# Altium schematic sheet Relay.SchDoc
size A
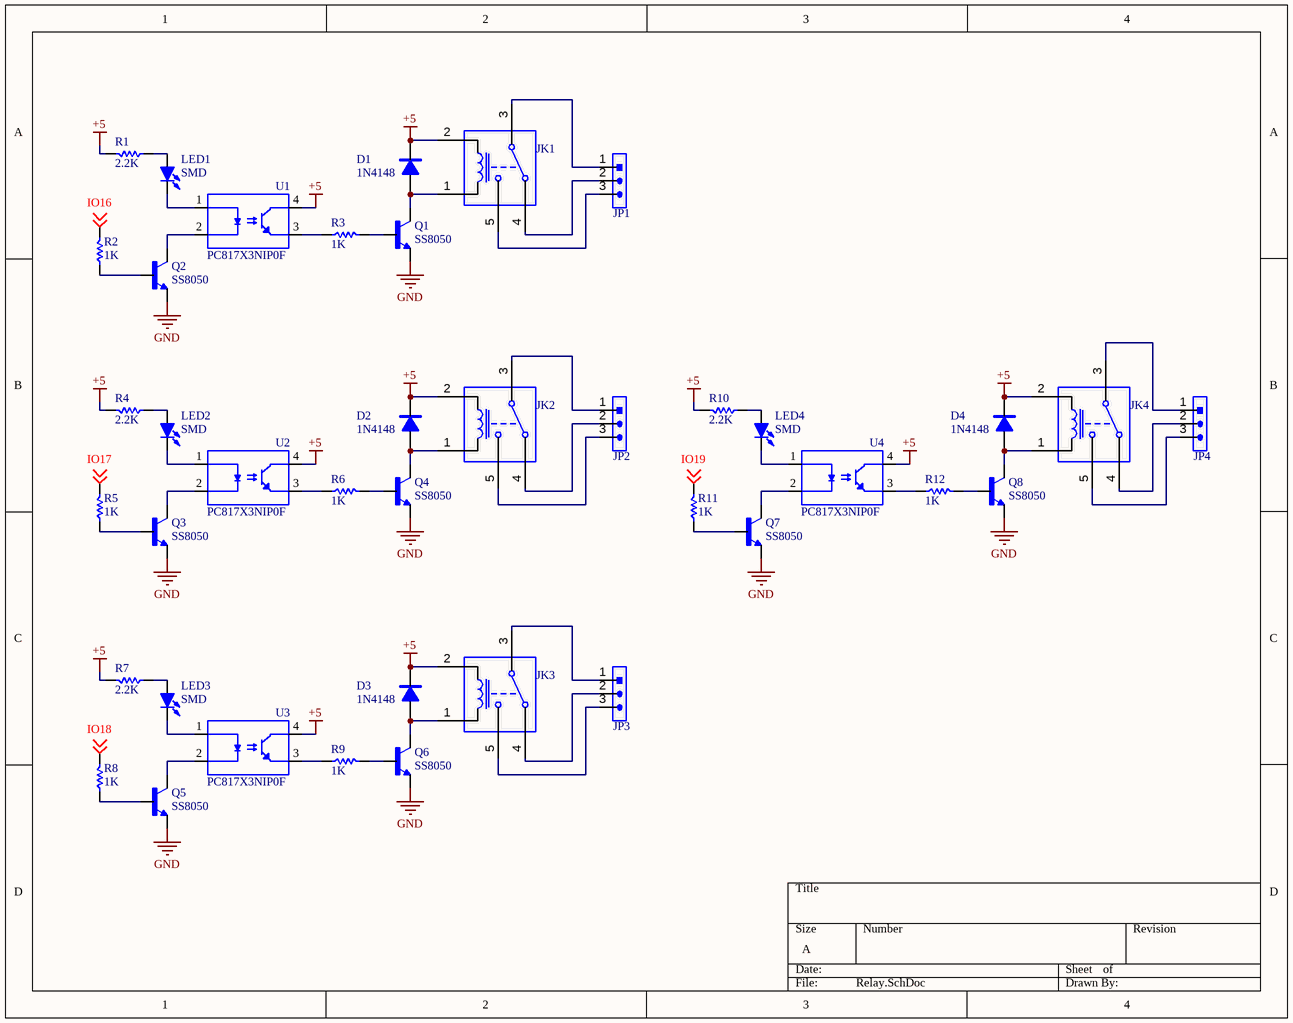
[diagram p0: Relay.SchDoc]

## Parts
D1  1N4148  [MINI_MELF (LL34)]
D2  1N4148  [MINI_MELF (LL34)]
D3  1N4148  [MINI_MELF (LL34)]
D4  1N4148  [MINI_MELF (LL34)]
JK1  SRD-05VDC-SL-C  [SRD-C_B]  (value not drawn)
JK2  SRD-05VDC-SL-C  [SRD-C_B]  (value not drawn)
JK3  SRD-05VDC-SL-C  [SRD-C_B]  (value not drawn)
JK4  SRD-05VDC-SL-C  [SRD-C_B]  (value not drawn)
JP1  HDR-1X3  [KF301-3P]  (value not drawn)
JP2  HDR-1X3  [KF301-3P]  (value not drawn)
JP3  HDR-1X3  [KF301-3P]  (value not drawn)
JP4  HDR-1X3  [KF301-3P]  (value not drawn)
LED1  SMD  [LED 0805B]
LED2  SMD  [LED 0805B]
LED3  SMD  [LED 0805B]
LED4  SMD  [LED 0805B]
Q1  SS8050  [SOT23-BEC]
Q2  SS8050  [SOT23-BEC]
Q3  SS8050  [SOT23-BEC]
Q4  SS8050  [SOT23-BEC]
Q5  SS8050  [SOT23-BEC]
Q6  SS8050  [SOT23-BEC]
Q7  SS8050  [SOT23-BEC]
Q8  SS8050  [SOT23-BEC]
R1  2.2K  [R 0805]
R2  1K  [R 0805]
R3  1K  [R 0805]
R4  2.2K  [R 0805]
R5  1K  [R 0805]
R6  1K  [R 0805]
R7  2.2K  [R 0805]
R8  1K  [R 0805]
R9  1K  [R 0805]
R10  2.2K  [R 0805]
R11  1K  [R 0805]
R12  1K  [R 0805]
U1  PC817X3NIP0F  [SOIC254P1000X400-4N]
U2  PC817X3NIP0F  [SOIC254P1000X400-4N]
U3  PC817X3NIP0F  [SOIC254P1000X400-4N]
U4  PC817X3NIP0F  [SOIC254P1000X400-4N]

## Nets
+5: D1.2(K) D2.2(K) D3.2(K) D4.2(K) JK1.2(Coil_2) JK2.2(Coil_2) JK3.2(Coil_2) JK4.2(Coil_2) R1.2 R4.2 R7.2 R10.2 U1.4(COLLECTOR) U2.4(COLLECTOR) U3.4(COLLECTOR) U4.4(COLLECTOR)
GND: Q1.E Q2.E Q3.E Q4.E Q5.E Q6.E Q7.E Q8.E
IO16: R2.2 ; off-sheet IO16
IO17: R5.2 ; off-sheet IO17
IO18: R8.2 ; off-sheet IO18
IO19: R11.2 ; off-sheet IO19
NetD1_1: D1.1(A) JK1.1(Coil_1) Q1.C
NetD2_1: D2.1(A) JK2.1(Coil_1) Q4.C
NetD3_1: D3.1(A) JK3.1(Coil_1) Q6.C
NetD4_1: D4.1(A) JK4.1(Coil_1) Q8.C
NetJK1_3: JK1.3 JP1.1
NetJK1_4: JK1.4 JP1.2
NetJK1_5: JK1.5 JP1.3
NetJK2_3: JK2.3 JP2.1
NetJK2_4: JK2.4 JP2.2
NetJK2_5: JK2.5 JP2.3
NetJK3_3: JK3.3 JP3.1
NetJK3_4: JK3.4 JP3.2
NetJK3_5: JK3.5 JP3.3
NetJK4_3: JK4.3 JP4.1
NetJK4_4: JK4.4 JP4.2
NetJK4_5: JK4.5 JP4.3
NetLED1_1: LED1.1(A) R1.1
NetLED1_2: LED1.2(K) U1.1(ANODE)
NetLED2_1: LED2.1(A) R4.1
NetLED2_2: LED2.2(K) U2.1(ANODE)
NetLED3_1: LED3.1(A) R7.1
NetLED3_2: LED3.2(K) U3.1(ANODE)
NetLED4_1: LED4.1(A) R10.1
NetLED4_2: LED4.2(K) U4.1(ANODE)
NetQ1_B: Q1.B R3.2
NetQ2_B: Q2.B R2.1
NetQ2_C: Q2.C U1.2(CATHODE)
NetQ3_B: Q3.B R5.1
NetQ3_C: Q3.C U2.2(CATHODE)
NetQ4_B: Q4.B R6.2
NetQ5_B: Q5.B R8.1
NetQ5_C: Q5.C U3.2(CATHODE)
NetQ6_B: Q6.B R9.2
NetQ7_B: Q7.B R11.1
NetQ7_C: Q7.C U4.2(CATHODE)
NetQ8_B: Q8.B R12.2
NetR3_1: R3.1 U1.3(EMITTER)
NetR6_1: R6.1 U2.3(EMITTER)
NetR9_1: R9.1 U3.3(EMITTER)
NetR12_1: R12.1 U4.3(EMITTER)

## Library data of the parts
D1-D4 = 1N4148: High speed switching diode; BOM名称: 高速开关二极管; 版权归属: 源创客; 学习资源: www.ooocke.com
JK1-JK4 = SRD-05VDC-SL-C: 5V单路双控继电器; BOM名称: 5V继电器; 版权归属: 源创客; 学习资源: www.ooocke.com
JP1-JP4 = Header 3: 3P Connector; BOM名称: 3P接插件; 版权归属: 源创客; 学习资源: www.ooocke.com
LED1-LED4 = LED-SMD: Blue LED; BOM名称: 贴片LED; 版权归属: 源创客; 学习资源: www.ooocke.com
Q1-Q8 = BCW31*: Bipolar _BJT_ Transistor NPN General Purpose Amplifier Surface Mount; MF: ON Semiconductor; MP: BCW31; Package: SOT-23 ON Semiconductor; Value: *; Availability: Unavailable; SnapEDA_Link: https://www.snapeda.com/parts/BCW31/ON%20Semiconductor/view-part/573820/?ref=snap; Price: None
R1-R12 = R: Chip resistor; 版权归属: 源创客; BOM名称: Chip resistor; 学习资源: www.ooocke.com
U1-U4 = PC817X3NIP0F: Optoisolator Transistor Output 5000Vrms 1 Channel 4-SMD; MF: SHARP/Socle Technology; Price: None; Availability: Unavailable; Package: SMD-4 SOCLE Technology; SnapEDA_Link: https://www.snapeda.com/parts/PC817X3NIP0F/SHARP/Socle%20Technology/view-part/2774503/?ref=snap; MP: PC817X3NIP0F; Value: *